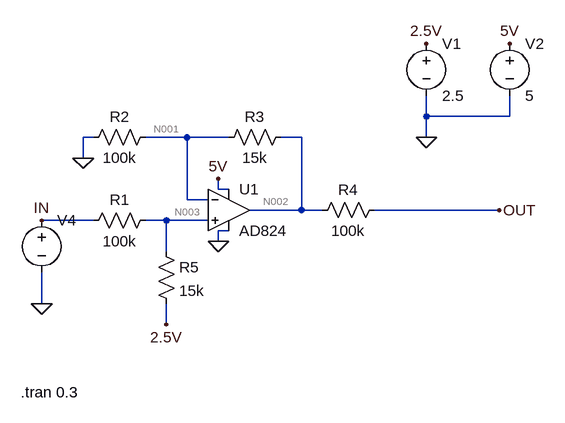
[diagram p0: schematic lvl_shifter.asc]
lvl_shifter.asc, the LTspice schematic file:
Version 4
SHEET 1 880 680
WIRE 416 32 416 0
WIRE 544 32 544 0
WIRE 544 32 416 32
WIRE -96 64 -112 64
WIRE 48 64 -16 64
WIRE 112 64 48 64
WIRE 224 64 192 64
WIRE 416 64 416 32
WIRE -112 96 -112 64
WIRE 96 144 96 128
WIRE 112 144 96 144
WIRE 48 160 48 64
WIRE 80 160 48 160
WIRE 224 176 224 64
WIRE 224 176 144 176
WIRE 256 176 224 176
WIRE 528 176 336 176
WIRE -96 192 -176 192
WIRE 16 192 -16 192
WIRE 80 192 16 192
WIRE 112 208 96 208
WIRE 96 224 96 208
WIRE 16 240 16 192
WIRE -176 320 -176 272
WIRE 16 352 16 320
FLAG -112 96 0
FLAG 416 64 0
FLAG 416 -80 2.5V
FLAG 544 -80 5V
FLAG -176 320 0
FLAG 96 128 5V
FLAG 96 224 0
FLAG 528 176 OUT
FLAG 16 352 2.5V
FLAG -176 192 IN
SYMBOL res 0 176 R90
WINDOW 0 0 56 VBottom 2
WINDOW 3 32 56 VTop 2
SYMATTR InstName R1
SYMATTR Value 100k
SYMBOL res 0 48 R90
WINDOW 0 0 56 VBottom 2
WINDOW 3 32 56 VTop 2
SYMATTR InstName R2
SYMATTR Value 100k
SYMBOL res 208 48 R90
WINDOW 0 0 56 VBottom 2
WINDOW 3 32 56 VTop 2
SYMATTR InstName R3
SYMATTR Value 15k
SYMBOL res 352 160 R90
WINDOW 0 0 56 VBottom 2
WINDOW 3 32 56 VTop 2
SYMATTR InstName R4
SYMATTR Value 100k
SYMBOL res 0 224 R0
SYMATTR InstName R5
SYMATTR Value 15k
SYMBOL voltage 416 -96 R0
WINDOW 123 0 0 Left 0
WINDOW 39 0 0 Left 0
SYMATTR InstName V1
SYMATTR Value 2.5
SYMBOL voltage 544 -96 R0
WINDOW 123 0 0 Left 0
WINDOW 39 0 0 Left 0
SYMATTR InstName V2
SYMATTR Value 5
SYMBOL voltage -176 176 R0
WINDOW 123 0 0 Left 0
WINDOW 39 0 0 Left 0
WINDOW 3 24 96 Invisible 2
SYMATTR InstName V4
SYMATTR Value SINE(0 15 200 0 0 0 50)
SYMBOL OpAmps\\AD824 112 112 R0
SYMATTR InstName U1
TEXT -208 456 Left 2 !.tran 0.3

The netlist it stands for:
* lvl_shifter.asc
R1 N003 IN 100k
R2 N001 0 100k
R3 N002 N001 15k
R4 OUT N002 100k
R5 N003 2.5V 15k
V1 2.5V 0 2.5
V2 5V 0 5
V4 IN 0 SINE(0 15 200 0 0 0 50)
XU1 N003 N001 5V 0 N002 AD824  ; pins In+ In- V+ V- OUT
.tran 0.3
.backanno
.end

* Results of the author's LTspice run, read from the files saved beside the schematic
* Operating Point, zero values left out:
*   V(n003) = 2.174 V
*   V(n001) = 2.174 V
*   V(n002) = 2.5 V
*   V(out) = 2.5 V
*   V(2.5v) = 2.5 V
*   V(5v) = 5 V
*   I(R1) = 21.74 µA
*   I(R2) = 21.74 µA
*   I(R3) = 21.74 µA
*   I(R5) = -21.74 µA
*   I(V1) = -21.74 µA
*   I(V2) = -682.8 µA
*   I(V4) = 21.74 µA
*   Ix(u1:1) = 1.984 pA
*   Ix(u1:2) = 1.984 pA
*   Ix(u1:3) = 682.8 µA
*   Ix(u1:4) = -661.1 µA
*   Ix(u1:5) = -21.74 µA
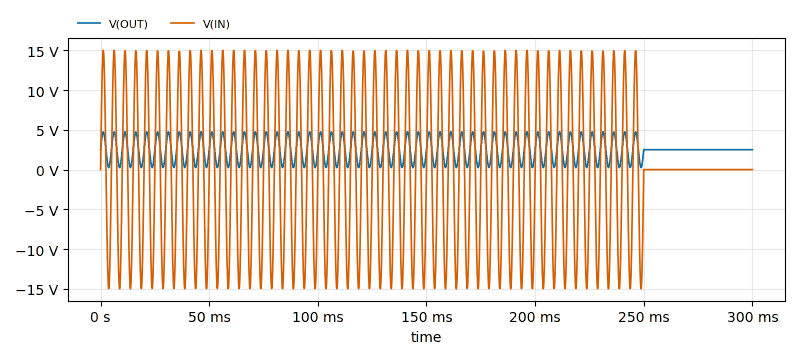
[diagram p1: Transient Analysis of lvl_shifter.asc, plotted from the saved traces]
* Transient Analysis, 1 run:
*   V(OUT): min 250 mV, max 4.75 V, average 2.5 V, rms 2.884 V, last 2.5 V
*   V(IN): min -15 V, max 15 V, average -946.8 µV, rms 9.721 V, last 0 V